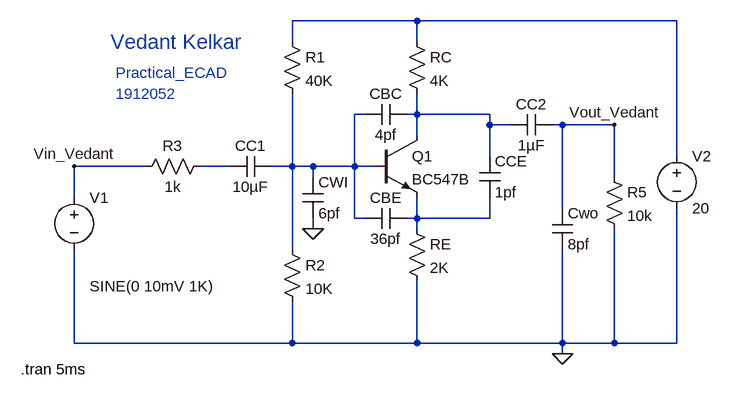
[diagram p0: schematic Practical.asc]
Practical.asc, the LTspice schematic file:
Version 4
SHEET 1 952 680
WIRE 496 -128 304 -128
WIRE 896 -128 496 -128
WIRE 304 -96 304 -128
WIRE 496 -96 496 -128
WIRE 416 16 400 16
WIRE 496 16 496 -16
WIRE 496 16 480 16
WIRE 608 16 496 16
WIRE 608 32 608 16
WIRE 640 32 608 32
WIRE 720 32 704 32
WIRE 800 32 720 32
WIRE 496 48 496 16
WIRE 608 80 608 32
WIRE 896 80 896 -128
WIRE 80 96 -32 96
WIRE 208 96 160 96
WIRE 304 96 304 -16
WIRE 304 96 272 96
WIRE 336 96 304 96
WIRE 400 96 400 16
WIRE 400 96 336 96
WIRE 432 96 400 96
WIRE 336 112 336 96
WIRE 800 112 800 32
WIRE -32 144 -32 96
WIRE 720 160 720 32
WIRE 400 176 400 96
WIRE 416 176 400 176
WIRE 496 176 496 144
WIRE 496 176 480 176
WIRE 608 176 608 144
WIRE 608 176 496 176
WIRE 336 192 336 176
WIRE 496 192 496 176
WIRE 304 224 304 96
WIRE -32 368 -32 224
WIRE 304 368 304 304
WIRE 304 368 -32 368
WIRE 496 368 496 272
WIRE 496 368 304 368
WIRE 720 368 720 224
WIRE 720 368 496 368
WIRE 800 368 800 192
WIRE 800 368 720 368
WIRE 896 368 896 160
WIRE 896 368 800 368
WIRE 720 384 720 368
FLAG 720 384 0
FLAG 336 192 0
FLAG 800 32 Vout_Vedant
FLAG -32 96 Vin_Vedant
SYMBOL voltage -32 128 R0
WINDOW 3 24 152 Left 2
WINDOW 123 24 124 Left 2
WINDOW 39 0 0 Left 0
SYMATTR InstName V1
SYMATTR Value SINE(0 10mV 1K)
SYMBOL res 176 80 R90
WINDOW 0 0 56 VBottom 2
WINDOW 3 32 56 VTop 2
SYMATTR InstName R3
SYMATTR Value 1k
SYMBOL res 288 -112 R0
SYMATTR InstName R1
SYMATTR Value 40K
SYMBOL res 288 208 R0
SYMATTR InstName R2
SYMATTR Value 10K
SYMBOL res 480 -112 R0
SYMATTR InstName RC
SYMATTR Value 4K
SYMBOL npn 432 48 R0
SYMATTR InstName Q1
SYMATTR Value BC547B
SYMBOL res 480 176 R0
SYMATTR InstName RE
SYMATTR Value 2K
SYMBOL cap 272 80 R90
WINDOW 0 0 32 VBottom 2
WINDOW 3 32 32 VTop 2
SYMATTR InstName CC1
SYMATTR Value 10µF
SYMBOL cap 704 16 R90
WINDOW 0 0 32 VBottom 2
WINDOW 3 32 32 VTop 2
SYMATTR InstName CC2
SYMATTR Value 1µF
SYMBOL voltage 896 64 R0
SYMATTR InstName V2
SYMATTR Value 20
SYMBOL res 784 96 R0
SYMATTR InstName R5
SYMATTR Value 10k
SYMBOL cap 480 0 R90
WINDOW 0 0 32 VBottom 2
WINDOW 3 32 32 VTop 2
SYMATTR InstName CBC
SYMATTR Value 4pf
SYMBOL cap 480 160 R90
WINDOW 0 0 32 VBottom 2
WINDOW 3 32 32 VTop 2
SYMATTR InstName CBE
SYMATTR Value 36pf
SYMBOL cap 592 80 R0
SYMATTR InstName CCE
SYMATTR Value 1pf
SYMBOL cap 320 112 R0
SYMATTR InstName CWI
SYMATTR Value 6pf
SYMBOL cap 704 160 R0
SYMATTR InstName Cwo
SYMATTR Value 8pf
TEXT -114 408 Left 2 !.tran 5ms
TEXT 24 -96 Left 3 ;Vedant Kelkar
TEXT 32 -48 Left 2 ;Practical_ECAD
TEXT 32 -16 Left 2 ;1912052

The netlist it stands for:
* Practical.asc
V1 Vin_Vedant 0 SINE(0 10mV 1K)
R3 N004 Vin_Vedant 1k
R1 N001 N002 40K
R2 N002 0 10K
RC N001 N003 4K
Q1 N003 N002 N005 0 BC547B
RE N005 0 2K
CC1 N002 N004 10µF
CC2 Vout_Vedant N003 1µF
V2 N001 0 20
R5 Vout_Vedant 0 10k
CBC N003 N002 4pf
CBE N005 N002 36pf
CCE N003 N005 1pf
CWI N002 0 6pf
Cwo Vout_Vedant 0 8pf
.model NPN NPN
.model PNP PNP
.lib standard.bjt
.tran 5ms
* Vedant Kelkar
* Practical_ECAD
* 1912052
.backanno
.end